# Altium schematic sheet TR.SchDoc
size A
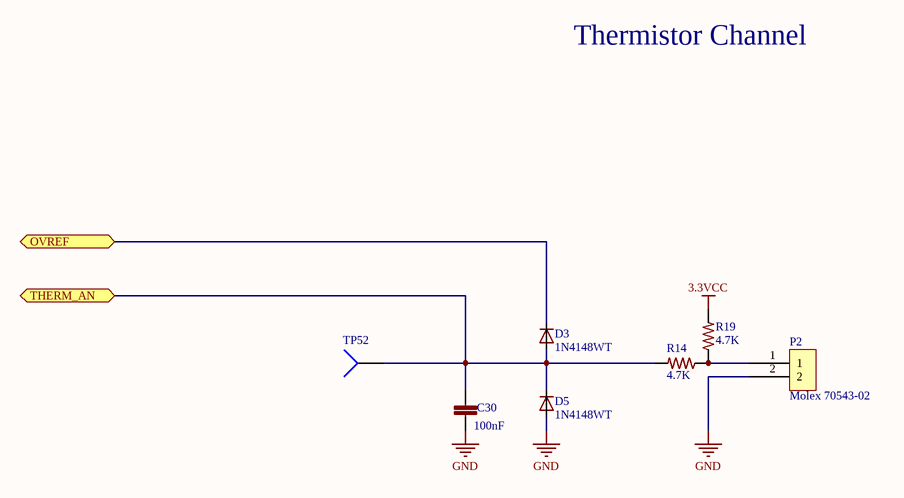
[diagram p0: TR.SchDoc]

## Parts
C30  100nF  [C0402]
D3  1N4148WT  [SOD523]
D5  1N4148WT  [SOD523]
P2  Molex 70543-02  [70543-02]
R14  4.7K  [R0603]
R19  4.7K  [R0603]
TP52  TP4  [TP-2]  (value not drawn)

## Ports
OVREF, THERM_AN

## Nets
3.3VCC: R19.2
GND: C30.2 D5.A P2.2
OVREF: D3.C ; port OVREF
THERM_AN: C30.1 D3.A D5.C R14.2 TP52.1 ; port THERM_AN
NetP2_1: P2.1 R14.1 R19.1

## Notes on the sheet
- Thermistor Channel

## Library data of the parts
C30 = GRM155R71C104KA88D: CAP CER 0402 100nF 16V 10% X7R; LastRevisionNote: ImportComponents; Published: 23-Apr-2014; Publisher: UltiMachine; LastRevisionDate: 23-Apr-2014; ManufacturerPartNumber: GRM155R71C104KA88D; VALUE: 100nF
D3 D5 = 1N4148WT: DIODE SOD523; LastRevisionNote: ImportComponents; Published: 23-Apr-2014; Publisher: UltiMachine; LastRevisionDate: 23-Apr-2014; Value: 1N4148WT
R14 R19 = ERJ3EKF4701V: RES 0603 4.7K 100mW 1%; LastRevisionNote: ImportComponents; Published: 23-Apr-2014; Publisher: UltiMachine; LastRevisionDate: 23-Apr-2014; ManufacturerPartNumber: ERJ3EKF4701V; VALUE: 4.7K
TP52 = Socket: LatestRevisionDate: 17-Jul-2002; LatestRevisionNote: Re-released for DXP Platform.; Publisher: Altium Limited